# EAGLE design jduino (EAGLE 6.4)
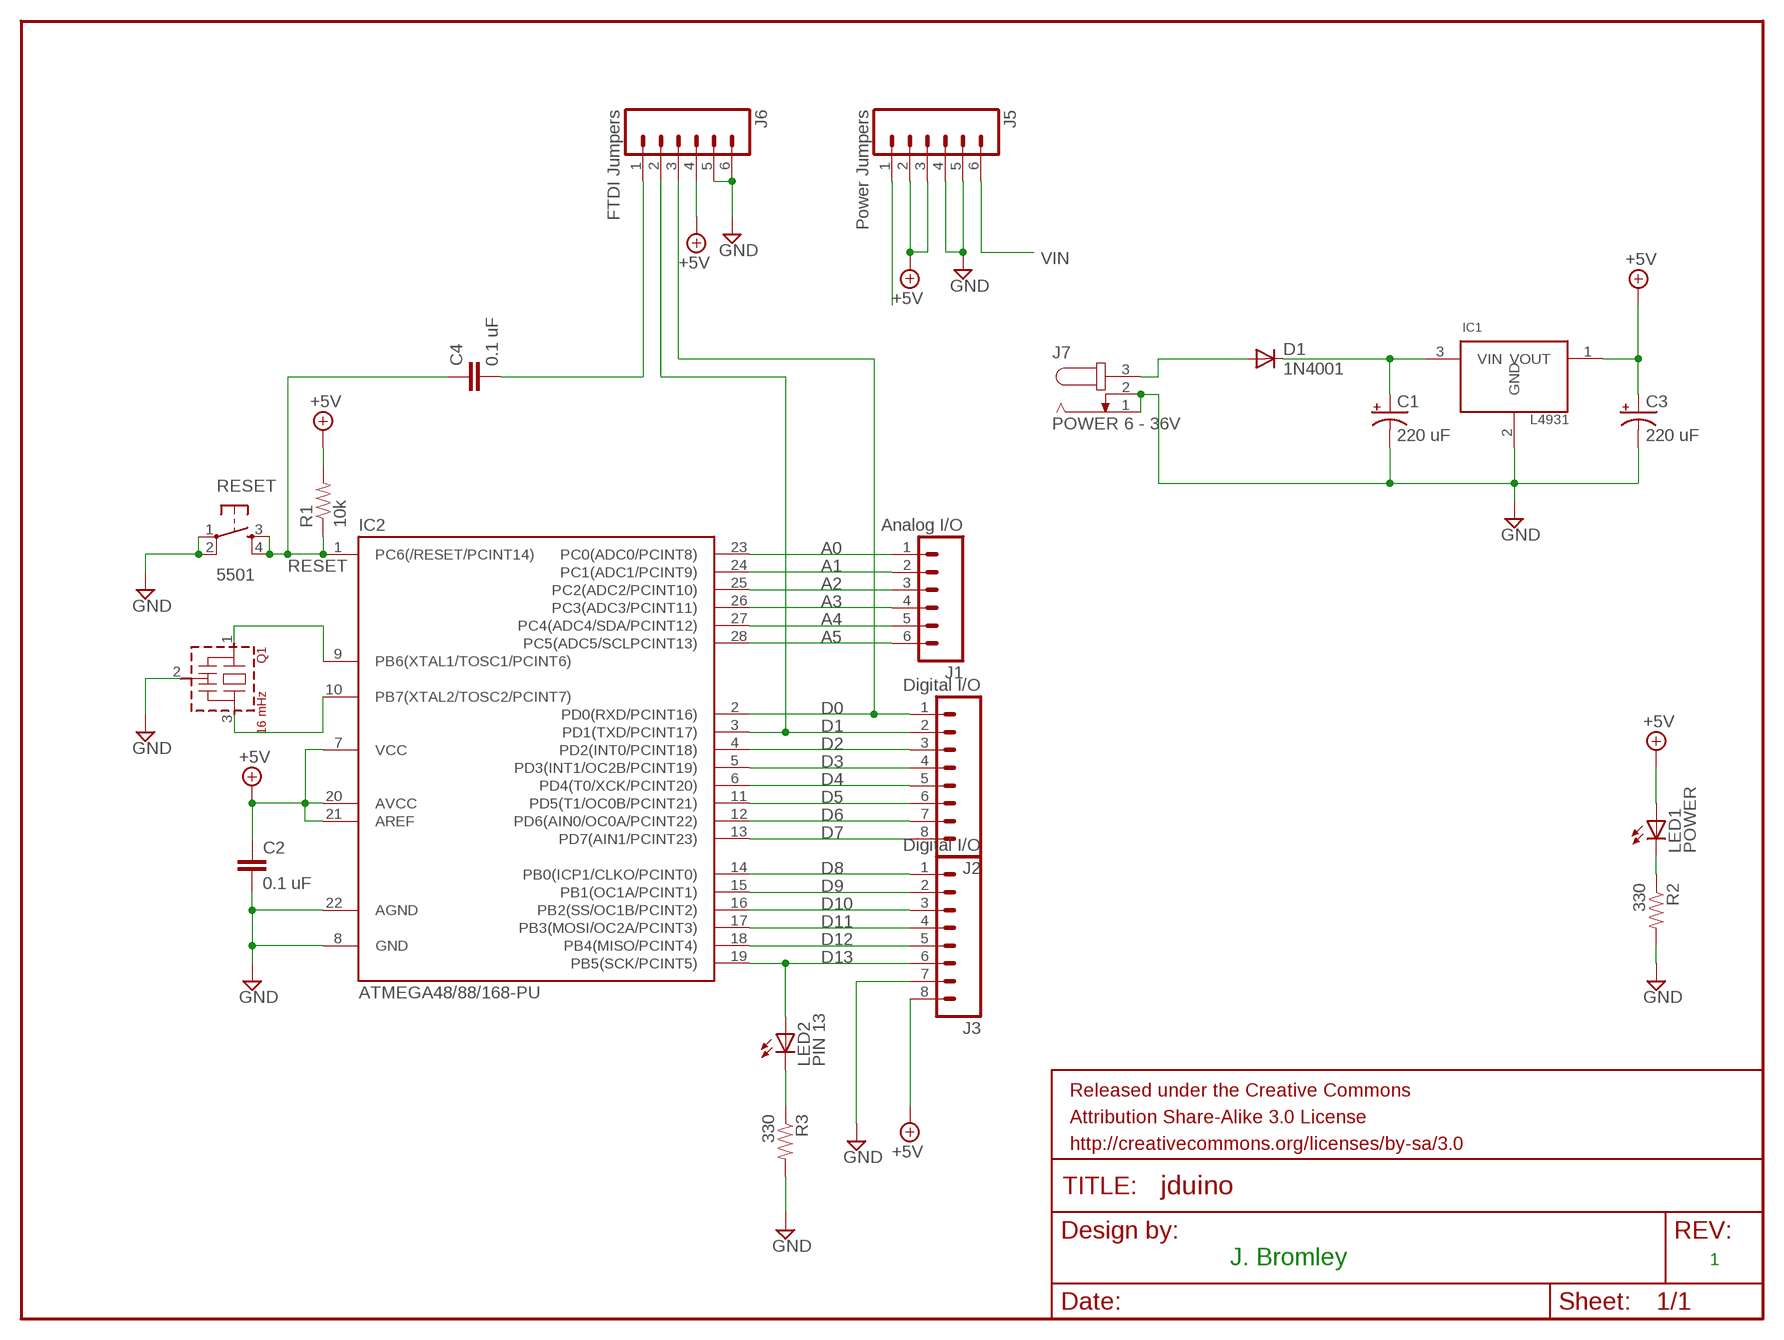
[diagram p0: schematic, sheet 1]

## Parts
C1  220 uF  CAP_POLPTH2  [CPOL-RADIAL-10UF-25V]
C2  0.1 uF  CAPPTH  [CAP-PTH-SMALL]
C3  220 uF  CAP_POLPTH2  [CPOL-RADIAL-10UF-25V]
C4  0.1 uF  CAPPTH  [CAP-PTH-SMALL]
D1  1N4001  DIODEPTH  [DIODE-1N4001]
IC1  L4931  [TO-92]
IC2  ATMEGA48/88/168-PU  [DIL28-3]
J1  Analog I/O  M06SIP  [1X06]
J2  Digital I/O  M08  [1X08]
J3  Digital I/O  M08  [1X08]
J5  Power Jumpers  M06SIP  [1X06]
J6  FTDI Jumpers  M06SIP  [1X06]
J7  POWER 6 - 36V  JACK-PLUG1  [SPC4078]
LED1  POWER  LED3MM  [LED3MM]
LED2  PIN 13  LED3MM  [LED3MM]
Q1  16 mHz  CSTLS_X  [CSTLS_X]
R1  10k  RESISTORAXIAL-0.3  [AXIAL-0.3]
R2  330  RESISTORAXIAL-0.3  [AXIAL-0.3]
R3  330  RESISTORAXIAL-0.3  [AXIAL-0.3]
RESET  5501  TAC_SWITCHPTH  [TACTILE-PTH]

## Nets
+5V [power]: C2.1 C3.1(+) IC1.1(VOUT) IC2.7(VCC) IC2.20(AVCC) IC2.21(AREF) J3.8 J5.2 J5.3 J6.4 LED1.A R1.P$2
A0: IC2.23(PC0(ADC0/PCINT8)) J1.1
A1: IC2.24(PC1(ADC1/PCINT9)) J1.2
A2: IC2.25(PC2(ADC2/PCINT10)) J1.3
A3: IC2.26(PC3(ADC3/PCINT11)) J1.4
A4: IC2.27(PC4(ADC4/SDA/PCINT12)) J1.5
A5: IC2.28(PC5(ADC5/SCLPCINT13)) J1.6
D0: IC2.2(PD0(RXD/PCINT16)) J2.1 J6.3
D1: IC2.3(PD1(TXD/PCINT17)) J2.2 J6.2
D2: IC2.4(PD2(INT0/PCINT18)) J2.3
D3: IC2.5(PD3(INT1/OC2B/PCINT19)) J2.4
D4: IC2.6(PD4(T0/XCK/PCINT20)) J2.5
D5: IC2.11(PD5(T1/OC0B/PCINT21)) J2.6
D6: IC2.12(PD6(AIN0/OC0A/PCINT22)) J2.7
D7: IC2.13(PD7(AIN1/PCINT23)) J2.8
D8: IC2.14(PB0(ICP1/CLKO/PCINT0)) J3.1
D9: IC2.15(PB1(OC1A/PCINT1)) J3.2
D10: IC2.16(PB2(SS/OC1B/PCINT2)) J3.3
D11: IC2.17(PB3(MOSI/OC2A/PCINT3)) J3.4
D12: IC2.18(PB4(MISO/PCINT4)) J3.5
D13: IC2.19(PB5(SCK/PCINT5)) J3.6 LED2.A
GND [power]: C1.2(-) C2.2 C3.2(-) IC1.2(GND) IC2.8(GND) IC2.22(AGND) J3.7 J5.4 J5.5 J6.5 J6.6 J7.1 J7.2 Q1.2(VSS) R2.P$2 R3.P$2 RESET.1 RESET.2
N$1: C4.2 J6.1
N$2 [power]: D1.A J7.3
N$3: IC2.10(PB7(XTAL2/TOSC2/PCINT7)) Q1.3
N$4: LED2.K(C) R3.P$1
N$5: IC2.9(PB6(XTAL1/TOSC1/PCINT6)) Q1.1
N$6 [power]: C1.1(+) D1.C IC1.3(VIN)
N$26: LED1.K(C) R2.P$1
RESET: C4.1 IC2.1(PC6(/RESET/PCINT14)) J5.1 R1.P$1 RESET.3 RESET.4
VIN: J5.6

## Notes on the sheet
- J. Bromley | 1

## Library data of the parts
C1 C3 = SparkFun-Capacitors:CAP_POL: Capacitor Polarized These are standard SMD and PTH capacitors. Normally 10uF, 47uF, and 100uF in electrolytic and tantalum varieties. Always verify the external diameter of the through hole cap, it varies with capacity, voltage, and manufacturer. The EIA devices should be standard.
C2 C4 = SparkFun-Capacitors:CAP: Capacitor Standard 0603 ceramic capacitor, and 0.1" leaded capacitor.
D1 = SparkFun-DiscreteSemi:DIODE: Diode These are standard reverse protection diodes and small signal diodes. SMA package can handle up to about 1A. SOD-323 can handle about 200mA. What the SOD-323 package when ordering, there are some mfgs out there that are 5-pin packages.
IC1 = jb:L4931
IC2 = atmega8:ATMEGA48/88/168-PU
J1 J5 J6 = SparkFun:M06: Header 6 Standard 6-pin 0.1" header. Use with straight break away headers (SKU : PRT-00116), right angle break away headers (PRT-00553), swiss pins (PRT-00743), machine pins (PRT-00117), and female headers (PRT-00115). Molex polarized connector foot print use with SKU : PRT-08094 with associated crimp pins and housings. NOTES ON THE VARIANTS LOCK and LOCK_LONGPADS... This footprint was designed to help hold the alignment of a through-hole component (i.e. 6-pin header) while soldering it into place. You may notice that each hole has been shifted either up or down by 0.005 of an inch from it's more standard position (which is a perfectly straight line). This slight alteration caused the pins (the squares in the middle) to touch the edges of the holes. Because they are alternating, it causes a "brace" to hold the component in place. 0.005 has proven to be the perfect amount of "off-center" position when using our standard breakaway headers. Although looks a little odd when you look at the bare footprint, once you have a header in there, the alteration is very hard to notice. Also, if you push a header all the way into place, it is covered up entirely on the bottom side. This idea of altering the position of holes to aid alignment will be further integrated into the Sparkfun Library for other footprints. It can help hold any component with 3 or more connection pins.
J2 J3 = SparkFun:M08: Header 8 Standard 8-pin 0.1" header. Use with straight break away headers (SKU : PRT-00116), right angle break away headers (PRT-00553), swiss pins (PRT-00743), machine pins (PRT-00117), and female headers (PRT-00115).
J7 = con-jack:JACK-PLUG: DC POWER JACK Power Jack, DC, Right Angle, Through Hole, Rated 5A at 16VDC, PC Terminals Distributor: Farnell (www.Farnell.de) Drawing: 84N1161.pdf / 84N1162.pdf Manufacturer: SPC Technology (www.spctechnology.com) Type: SPC4077 / SPC 4078; OC_FARNELL: unknown; OC_NEWARK: unknown
LED1 LED2 = SparkFun-LED:LED: LEDs Standard schematic elements and footprints for 5mm, 3mm, 1206, and 0603 sized LEDs. 5mm - Spark Fun Electronics SKU : COM-00529 (and others)
Q1 = murata-resonators:CSTLS_X: Ceramic resonator 16.00 to 70.00 MHz
R1 = SparkFun-Passives:RESISTOR: Resistor Basic schematic elements and footprints for 0603, 1206, and PTH resistors.
R2 R3 = SparkFun-Resistors:RESISTOR: Resistor Basic schematic elements and footprints for 0603, 1206, and PTH resistors.
RESET = SparkFun:TAC_SWITCH: Momentary Switch Button commonly used for reset or general input. Spark Fun Electronics SKU : COM-00097

## Net classes
0 default: width 0.406 mm, drill 0.203 mm, clearance 0.203 mm
1 power: width 0.61 mm, drill 0.203 mm, clearance 0.203 mm

## Board
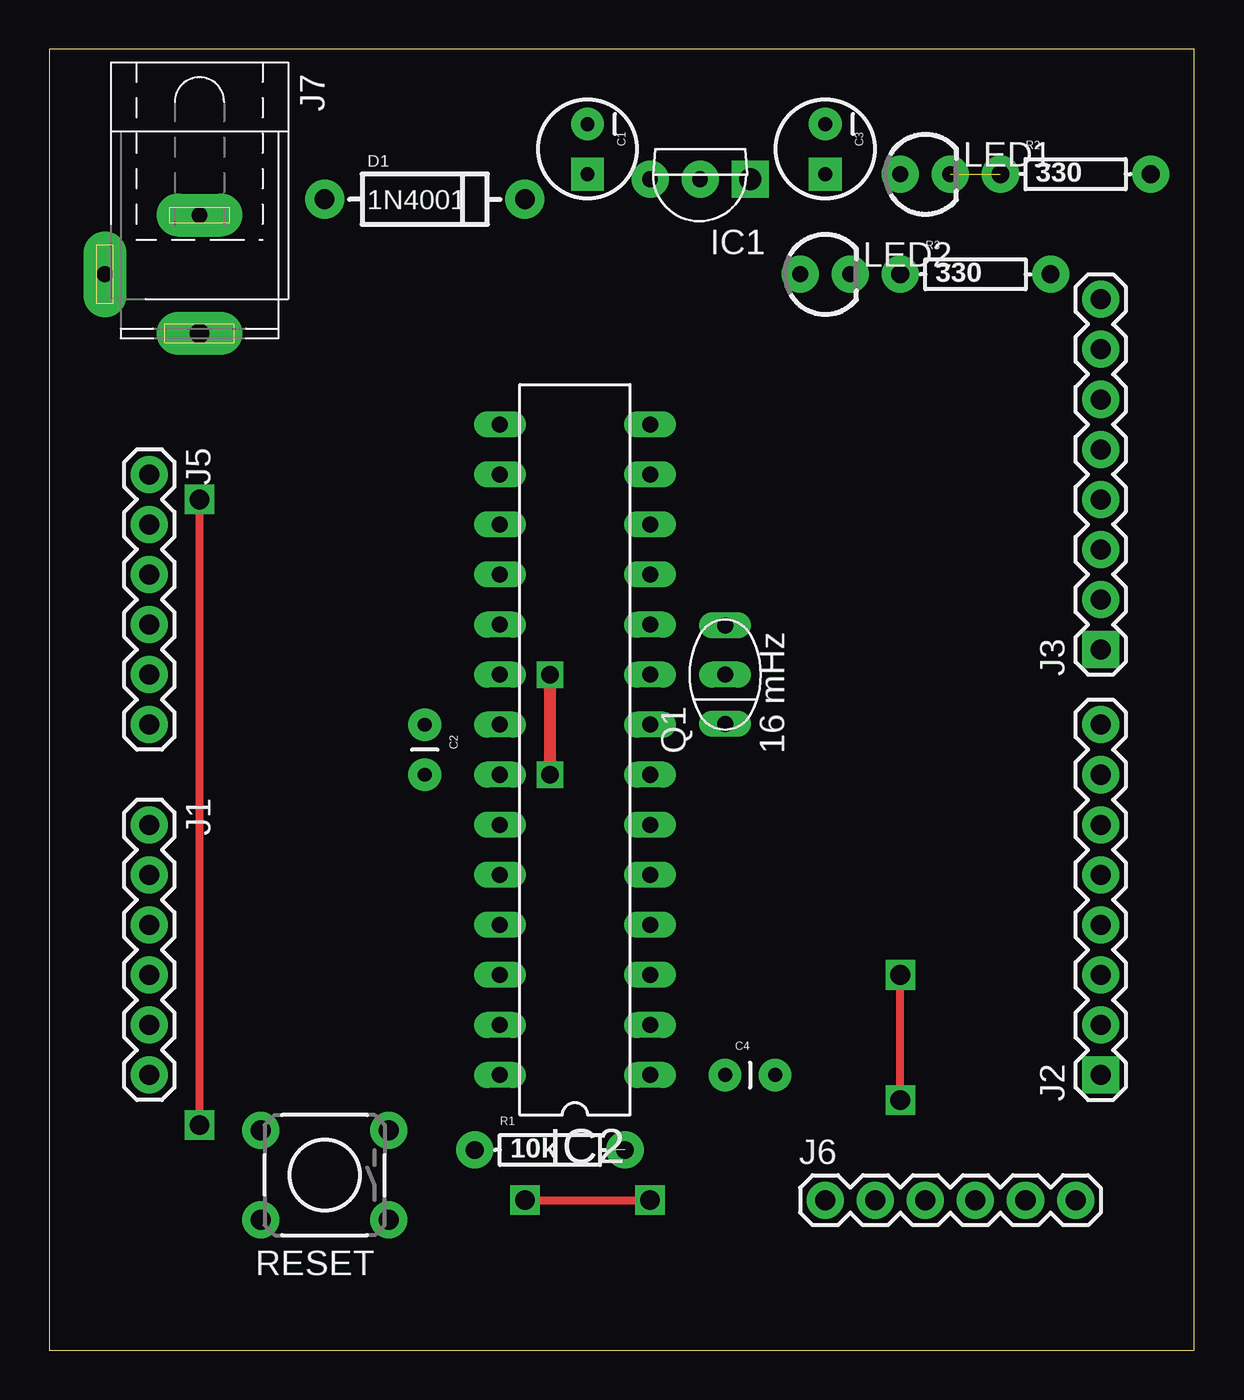
[diagram p1: board, top side]
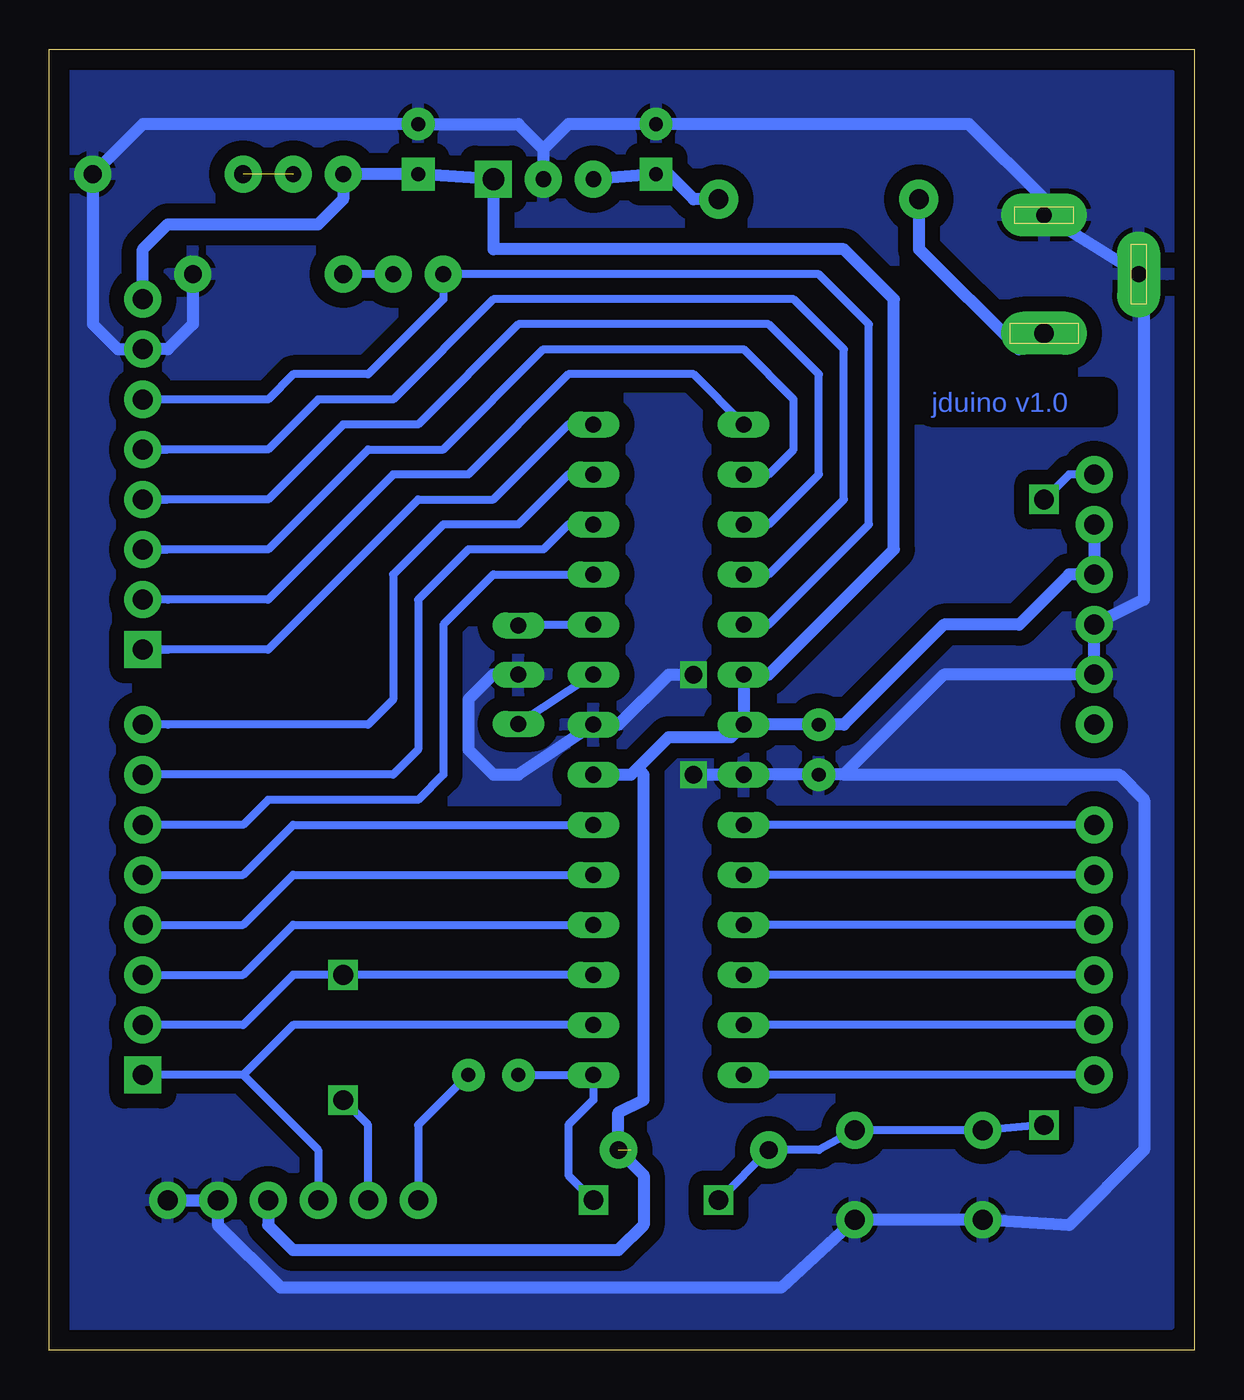
[diagram p2: board, bottom side, seen from below]

Size 58.09 x 66.03 mm. Coordinates in mm from the lower left corner, seen from the top.
Outline: 0,0 58.09,0 58.09,66.03 0,66.03 0,0
Copper layers (1*16): Top 0.035mm / dielectric 1.5mm / Bottom 0.035mm
Design rules "default": minimum track width 10mil, minimum drill 24mil, track to track 30mil, track to pad 30mil, pad to pad 8mil, via to via 8mil, smd to smd 8mil, copper to edge 40mil, drill to drill 8mil, minimum pad ring 10mil, minimum via ring 8mil, stop-mask expansion 4mil, vias tented up to drill 0mil, thermal gap 10mil

### Footprints (pad centres in the part's own frame; a part is rotated, then mirrored left to right if it is on the bottom)
CPOL-RADIAL-10UF-25V = drill 0.7 pad 1.651 square: 1 1.27,0 | drill 0.7 pad 1.651: 2 -1.27,0
CAP-PTH-SMALL = drill 0.7 pad 1.651: 1 0,0; 2 2.54,0
DIODE-1N4001 = drill 1 pad 1.981: A -5.08,0; C 5.08,0
TO-92 = drill 1.1 pad 1.88 square: 1 -2.54,-1.016 | drill 0.8 pad 1.88: 2 0,-1.016; 3 2.54,-1.016
DIL28-3 = drill 0.813 long: 1 -16.51,-3.81; 2 -13.97,-3.81; 3 -11.43,-3.81; 4 -8.89,-3.81; 5 -6.35,-3.81; 6 -3.81,-3.81; 7 -1.27,-3.81; 8 1.27,-3.81; 9 3.81,-3.81; 10 6.35,-3.81; 11 8.89,-3.81; 12 11.43,-3.81; 13 13.97,-3.81; 14 16.51,-3.81; 15 16.51,3.81; 16 13.97,3.81; 17 11.43,3.81; 18 8.89,3.81; 19 6.35,3.81; 20 3.81,3.81; 21 1.27,3.81; 22 -1.27,3.81; 23 -3.81,3.81; 24 -6.35,3.81; 25 -8.89,3.81; 26 -11.43,3.81; 27 -13.97,3.81; 28 -16.51,3.81
1X06 = drill 1.016 pad 1.88: 1 0,0; 2 2.54,0; 3 5.08,0; 4 7.62,0; 5 10.16,0; 6 12.7,0
1X08 = drill 1.016 pad 1.88 square: 1 0,0 | drill 1.016 pad 1.88: 2 2.54,0; 3 5.08,0; 4 7.62,0; 5 10.16,0; 6 12.7,0; 7 15.24,0; 8 17.78,0
SPC4078 = drill 0.8 pad 2.184 long: 1 -3,0; 2 0,-4.8 | drill 1 pad 2.184 long: 3 3,0
LED3MM = drill 0.813 pad 1.88: A -1.27,0; K 1.27,0
CSTLS_X = drill 0.813 long: 1 -2.5,0; 2 0,0; 3 2.5,0
AXIAL-0.3 = drill 0.9 pad 1.88: P$1 -3.81,0; P$2 3.81,0
TACTILE-PTH = drill 1.016 pad 1.88: 1 -3.251,2.261; 2 3.251,2.261; 3 -3.251,-2.261; 4 3.251,-2.261

### Placement (x,y rotation side)
C1  27.3,60.96 270 top
C2  19.05,31.75 270 top
C3  39.37,60.96 270 top
C4  34.29,13.97 0 top
D1  19.05,58.42 0 top
IC1  33.02,58.42 180 top
IC2  26.67,30.48 90 top
J1  5.08,26.67 270 top
J2  53.34,13.97 90 top
J3  53.34,35.56 90 top
J5  5.08,44.45 270 top
J6  39.37,7.62 0 top
J7  7.62,54.61 270 top
LED1  44.45,59.69 0 top
LED2  39.37,54.61 0 top
Q1  34.29,34.29 90 top
R1  25.4,10.16 0 top
R2  52.07,59.69 0 top
R3  46.99,54.61 0 top
RESET  13.97,8.89 180 top

### Tracks (layer width: path | path; a pad name or v marks a point on that pad's centre or on a via)
+5V  (1 unrouted)
  Bottom 0.61: IC2.21 IC2.20 21.59,34.29 15.24,40.64 15.24,53.34 17.78,55.88 35.56,55.88 IC1.1 C3.1 LED1.A 43.18,58.42 44.45,57.15 52.07,57.15 53.34,55.88 J3.8 | J6.4 46.99,6.35 45.72,5.08 29.21,5.08 27.94,6.35 27.94,8.89 R1.P$2 | J5.2 J5.3 6.35,39.37 8.89,36.83 12.7,36.83 17.78,31.75 C2.1 IC2.21 | IC2.21 23.5,31.11 26.67,31.11 28.26,29.53 | 28.57,10.16 29.21,10.79 29.21,12.06 27.94,12.7 27.94,29.21 28.26,29.53 | 28.26,29.53 28.57,29.21 IC2.7
A0
  Bottom 0.406: J1.1 IC2.23
A1
  Bottom 0.406: J1.2 IC2.24
A2
  Bottom 0.406: J1.3 IC2.25
A3
  Bottom 0.406: J1.4 IC2.26
A4
  Bottom 0.406: J1.5 IC2.27
A5
  Bottom 0.406: J1.6 IC2.28
D0
  Bottom 0.406: IC2.2 45.72,16.51 48.26,13.97 | 48.26,13.97 J2.1 | 48.26,13.97 44.45,10.16 J6.3
D1  (via drill 1)
  Top 0.406: v43.18,12.7 v43.18,19.05
  Bottom 0.406: IC2.3 v43.18,19.05 45.72,19.05 48.26,16.51 J2.2 | J6.2 41.91,11.43 v43.18,12.7
D2
  Bottom 0.406: J2.3 48.26,19.05 45.72,21.59 IC2.4
D3
  Bottom 0.406: J2.4 48.26,21.59 45.72,24.13 IC2.5
D4
  Bottom 0.406: J2.5 48.26,24.13 45.72,26.67 IC2.6
D5
  Bottom 0.406: IC2.11 35.56,39.37 38.1,36.83 38.1,29.21 39.37,27.94 46.99,27.94 48.26,26.67 J2.6
D6
  Bottom 0.406: IC2.12 31.75,41.91 33.02,40.64 36.83,40.64 39.37,38.1 39.37,30.48 40.64,29.21 J2.7
D7
  Bottom 0.406: IC2.13 31.75,44.45 34.29,41.91 38.1,41.91 40.64,39.37 40.64,33.02 41.91,31.75 J2.8 52.07,31.75
D8
  Bottom 0.406: 52.07,35.56 J3.1 46.99,35.56 39.37,43.18 35.56,43.18 31.75,46.99 IC2.14
D9
  Bottom 0.406: IC2.15 25.4,49.53 31.75,49.53 36.83,44.45 40.64,44.45 46.99,38.1 J3.2 52.07,38.1
D10
  Bottom 0.406: IC2.16 21.59,44.45 20.32,45.72 20.32,48.26 22.86,50.8 33.02,50.8 38.1,45.72 41.91,45.72 46.99,40.64 J3.3 52.07,40.64
D11
  Bottom 0.406: IC2.17 21.59,41.91 19.05,44.45 19.05,49.53 21.59,52.07 34.29,52.07 39.37,46.99 43.18,46.99 46.99,43.18 J3.4 52.07,43.18
D12
  Bottom 0.406: IC2.18 21.59,39.37 17.78,43.18 17.78,50.8 20.32,53.34 35.56,53.34 40.64,48.26 44.45,48.26 46.99,45.72 J3.5 52.07,45.72
D13
  Bottom 0.406: IC2.19 21.59,36.83 16.51,41.91 16.51,52.07 19.05,54.61 LED2.A 38.1,53.34 41.91,49.53 45.72,49.53 46.99,48.26 J3.6 52.07,48.26
GND  (via drill 0.9)
  Top 0.61: v25.4,34.29 v25.4,29.21
  Bottom 0.61: Q1.2 35.56,34.29 36.83,33.02 36.83,30.48 35.56,29.21 34.29,29.21 IC2.8 29.21,31.75 26.67,34.29 v25.4,34.29 | 17.78,29.21 12.7,34.29 J5.5 J5.4 2.54,38.1 2.54,54.61 J7.2 J7.1 7.62,58.42 11.43,62.23 C1.2 31.75,62.23 33.02,60.96 | J6.6 J6.5 49.53,6.35 46.35,3.17 20.95,3.17 RESET.1 RESET.2 6.35,6.35 2.54,10.16 2.54,27.94 3.81,29.21 17.78,29.21 | v25.4,29.21 IC2.22 C2.2 17.78,29.21 | 33.02,60.96 34.29,62.23 C3.2 53.34,62.23 R2.P$2 55.88,52.07 54.61,50.8 J3.7 52.07,50.8 50.8,52.07 R3.P$2 | 33.02,60.96 IC1.2
  pour Bottom: 1.27,1.27 1.27,64.77 57.15,64.77 57.15,63.5 57.15,1.27
N$1
  Bottom 0.406: J6.1 39.37,11.43 C4.2
N$2
  Bottom 0.61: J7.3 8.89,50.8 13.97,55.88 D1.A
N$3
  Bottom 0.406: Q1.3 34.29,36.83 IC2.10
N$4
  Bottom 0.406: LED2.K R3.P$1
N$5
  Bottom 0.406: IC2.9 Q1.1
N$6
  Bottom 0.61: IC1.3 C1.1 26.67,59.69 25.4,58.42 D1.C
N$26  (1 unrouted)
RESET  (via drill 1)
  Top 0.406: v7.62,43.18 v7.62,11.43 | v24.13,7.62 v30.48,7.62
  Bottom 0.406: J5.1 6.35,44.45 v7.62,43.18 | v7.62,11.43 RESET.4 RESET.3 19.05,10.16 R1.P$1 v24.13,7.62 | v30.48,7.62 31.75,8.89 31.75,11.43 30.48,12.7 IC2.1 C4.1

### Text on the board
Bottom: jduino v1.0